# EAGLE design schematics (EAGLE 9.6.2)
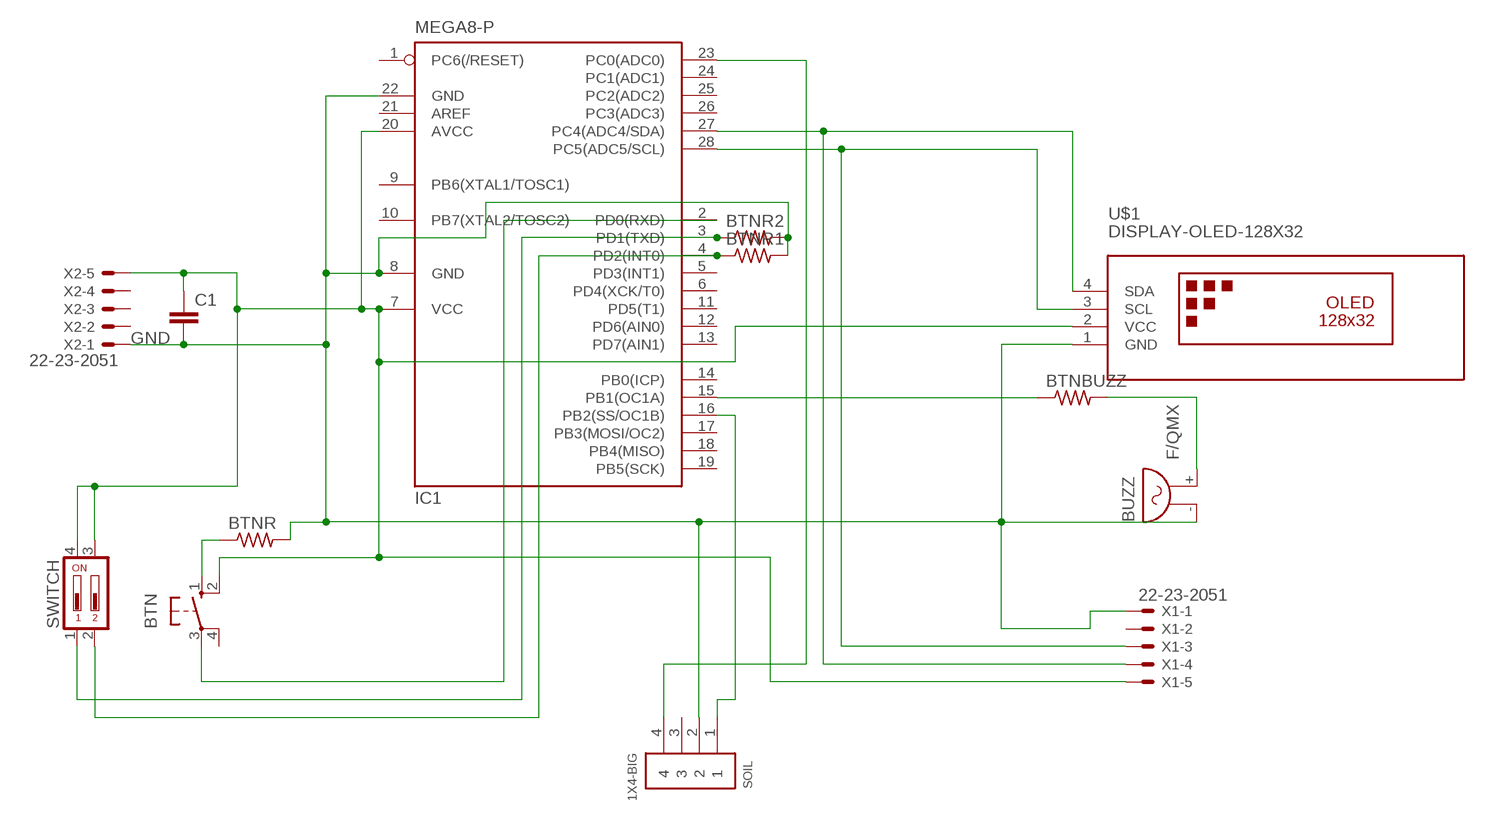
[diagram p0: schematic, sheet 1]

## Parts
BTN  10-XX  [B3F-10XX]
BTNBUZZ  R-US_0204/7  [0204/7]
BTNR  R-US_0204/7  [0204/7]
BTNR1  R-US_0204/7  [0204/7]
BTNR2  R-US_0204/7  [0204/7]
BUZZ  F/QMX  [F/QMX]
C1  C-EU025-025X050  [C025-025X050]
IC1  MEGA8-P  [DIL28-3]
SOIL  1X4-BIG  [1X04-BIG]
SWITCH  DIP02YL  [DIP02YL]
U$1  DISPLAY-OLED-128X32  [DISPLAY-OLED-128X32]
X1  22-23-2051  [22-23-2051]
X2  22-23-2051  [22-23-2051]

## Nets
GND: BTNR1.2 BTNR2.2 BTNR.2 BUZZ.- C1.2 IC1.8(GND) IC1.22(GND) SOIL.2 U$1.1(GND) X1.1 X2.1
N$1: IC1.27(PC4(ADC4/SDA)) U$1.4(SDA) X1.4
N$2: IC1.28(PC5(ADC5/SCL)) U$1.3(SCL) X1.3
N$3: BTNR2.1 IC1.3(PD1(TXD)) SWITCH.1
N$4: BTNBUZZ.1 IC1.15(PB1(OC1A))
N$5: BTN.2(S1) C1.1 IC1.7(VCC) IC1.20(AVCC) SWITCH.3 SWITCH.4 U$1.2(VCC) X1.5 X2.5
N$6: IC1.16(PB2(SS/OC1B)) SOIL.1
N$7: BTN.1(S) BTNR.1
N$8: BTN.3(P) IC1.2(PD0(RXD))
N$9: IC1.23(PC0(ADC0)) SOIL.4
N$10: BTNR1.1 IC1.4(PD2(INT0)) SWITCH.2
N$11: BTNBUZZ.2 BUZZ.+
Unconnected: BTN.4(P1) IC1.1(PC6(/RESET)) IC1.5(PD3(INT1)) IC1.6(PD4(XCK/T0)) IC1.9(PB6(XTAL1/TOSC1)) IC1.10(PB7(XTAL2/TOSC2)) IC1.11(PD5(T1)) IC1.12(PD6(AIN0)) IC1.13(PD7(AIN1)) IC1.14(PB0(ICP)) IC1.17(PB3(MOSI/OC2)) IC1.18(PB4(MISO)) IC1.19(PB5(SCK)) IC1.21(AREF) IC1.24(PC1(ADC1)) IC1.25(PC2(ADC2)) IC1.26(PC3(ADC3)) SOIL.3 X1.2 X2.2 X2.3 X2.4

## Library data of the parts
BTN = switch-omron:10-XX: OMRON SWITCH; MPN: B3F-1000; OC_FARNELL: 176432; OC_NEWARK: 36M3542
BTNBUZZ BTNR BTNR1 BTNR2 = adafruit:R-US_: RESISTOR, American symbol
BUZZ = buzzer:F/QMX: BUZZER Source: Buerklin; OC_FARNELL: unknown; OC_NEWARK: unknown
C1 = rcl:C-EU: CAPACITOR, European symbol; SPICEPREFIX: C
IC1 = atmel:MEGA8-P: MICROCONTROLLER 8 Kbytes FLASH, 1 kbytes SRAM, 512 bytes EEPROM, USART, 4-channel 10 bit ADC, 2-channel 8 bit ADC Pin compatible with Atmega48, ATMega88, ATMega168 Source: avr.lbr; OC_FARNELL: unknown; OC_NEWARK: unknown
SOIL = adafruit:1X4: 4-pin connector
SWITCH = switch-dil:DIP02YL: DIL/CODE SWITCH; OC_FARNELL: unknown; OC_NEWARK: unknown
U$1 = diy-modules:DISPLAY-OLED-128X32: 128x32 Dot Matrix OLED Module with I2C interface based on SSD1306 chip More details available here: http://www.tinyosshop.com/index.php?route=product/product&product_id=953 Schematic available here: http://www.tinyosshop.com/datasheet/OLED%2012832.pdf SSD1306 datasheet: https://cdn-shop.adafruit.com/datasheets/SSD1306.pdf Click here to find device on ebay.com <http://www.ebay.com/sch/oled+display+128x32+i2c>
X1 X2 = con-molex:22-23-2051: .100" (2.54mm) Center Header - 5 Pin; MF: MOLEX; MPN: 22-23-2051; OC_FARNELL: 1462952; OC_NEWARK: 38C9178

## Board
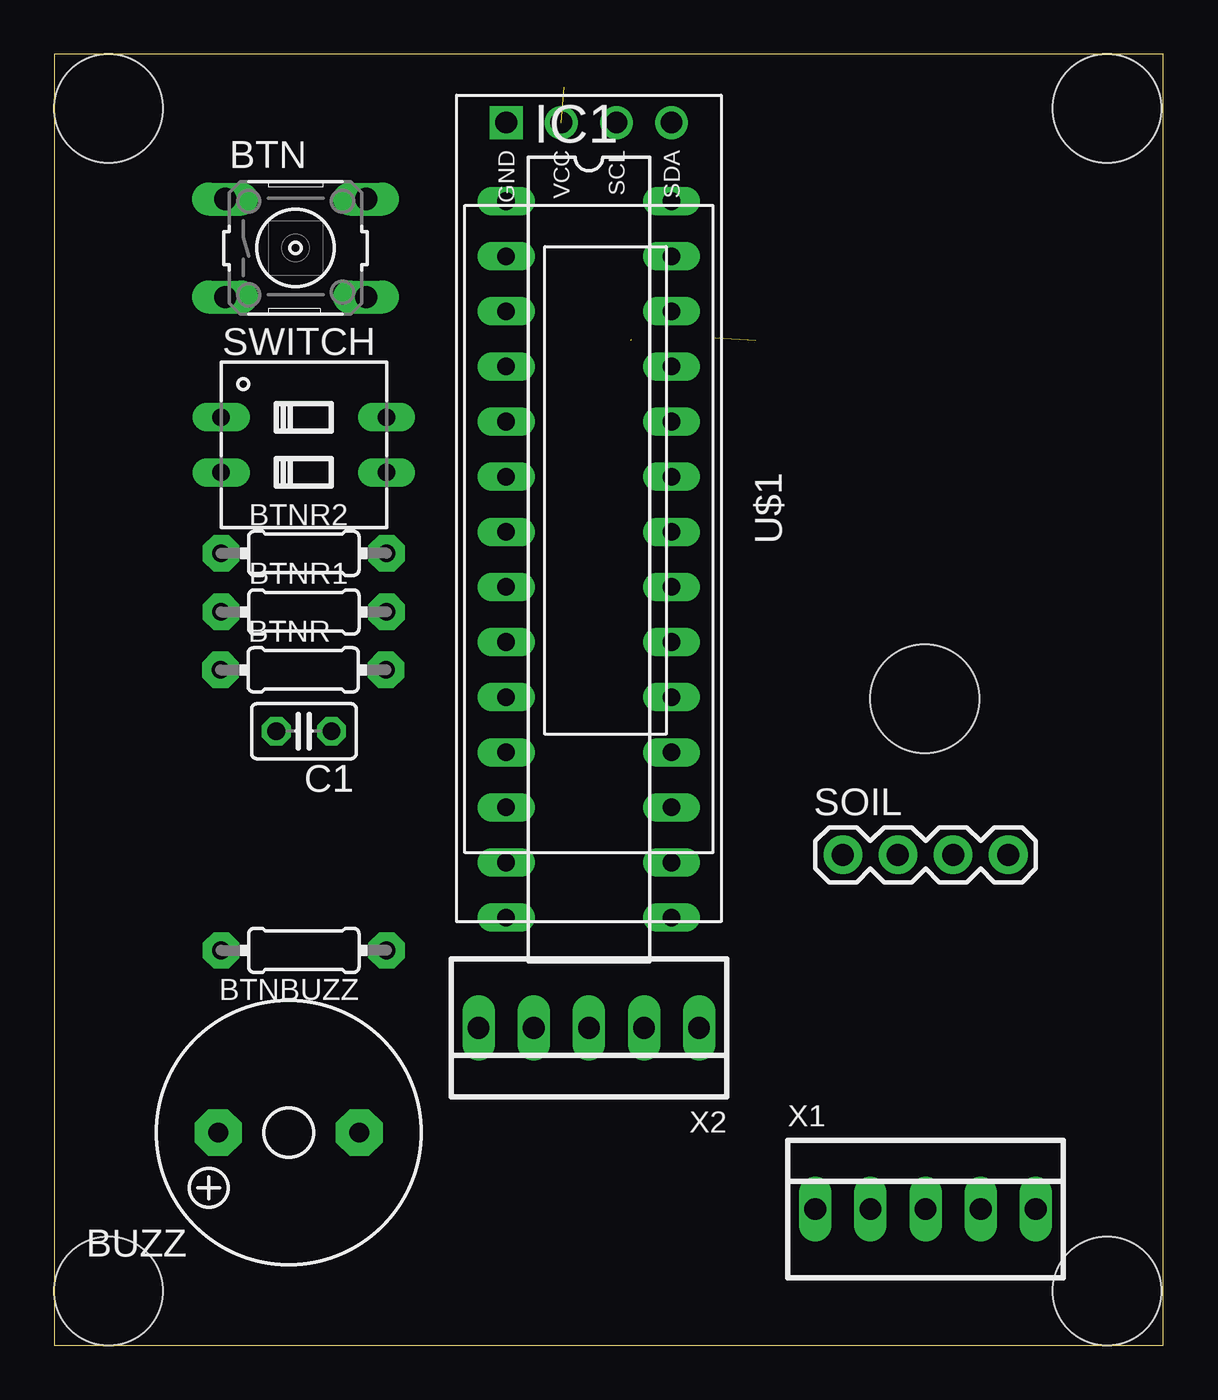
[diagram p1: board, top side]
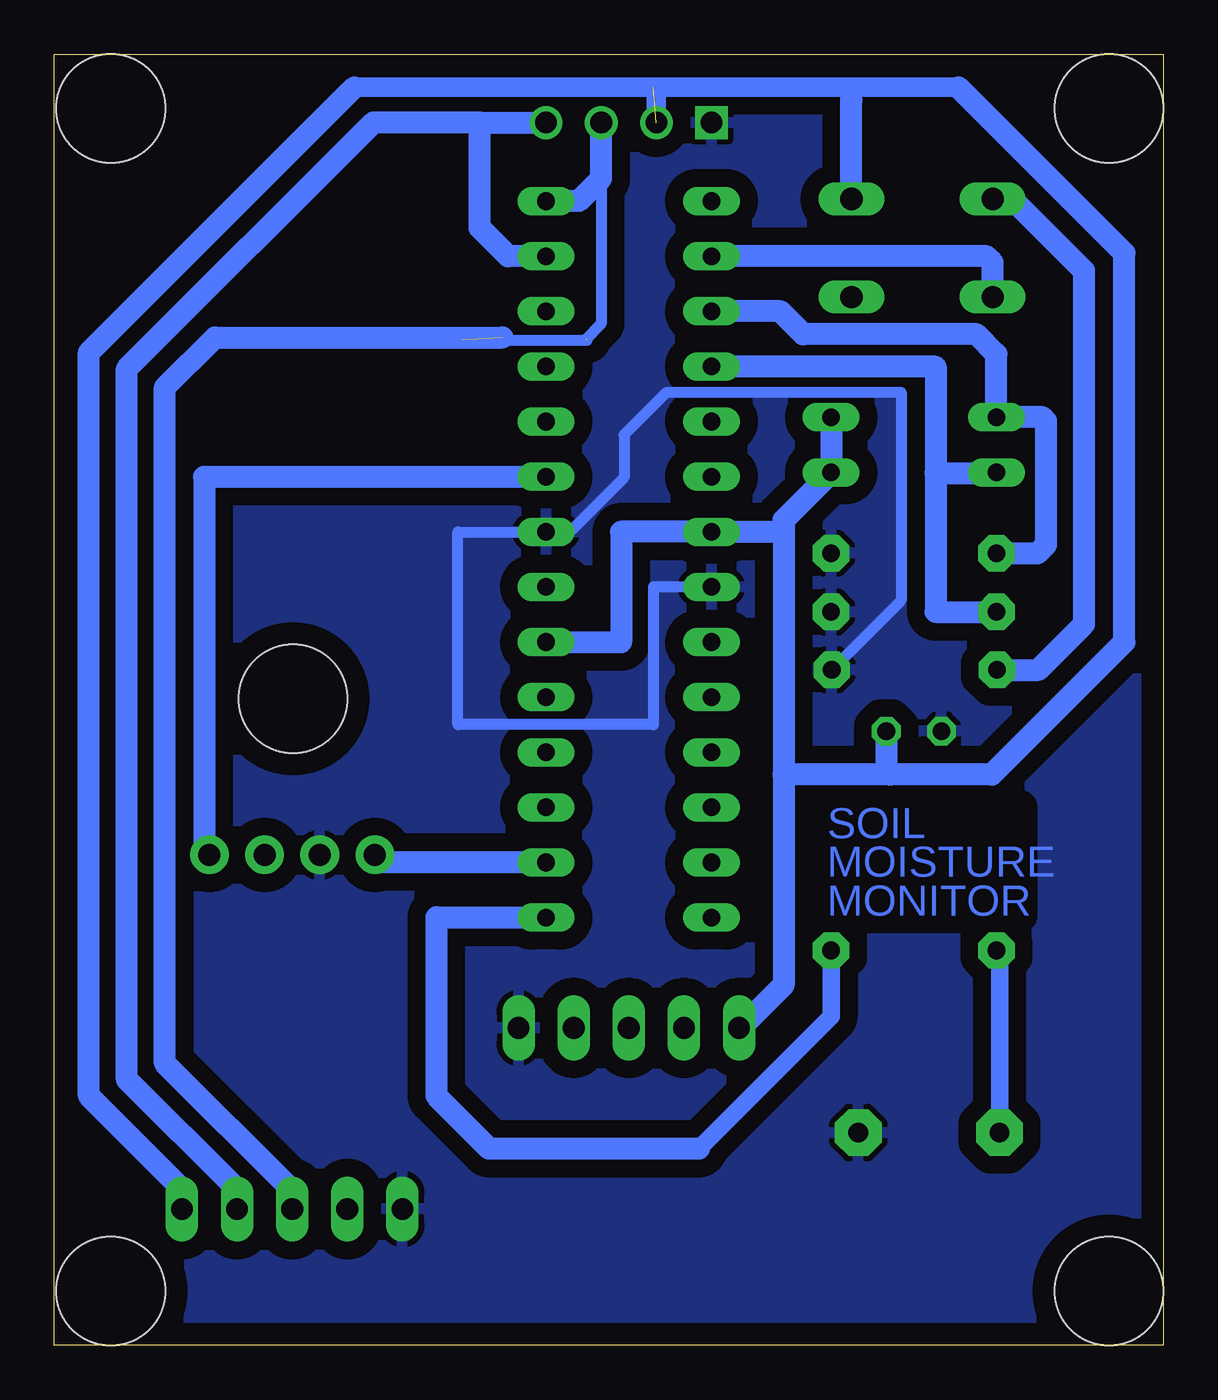
[diagram p2: board, bottom side, seen from below]

Size 51.1 x 59.5 mm. Coordinates in mm from the lower left corner, seen from the top.
Outline: 0,0 51.1,0 51.1,59.5 0,59.5 0,0
Copper layers (1*16): Top 0.035mm / dielectric 1.5mm / Bottom 0.035mm
Design rules "default *": minimum track width 6mil, minimum drill 0.35mm, track to track 6mil, track to pad 6mil, pad to pad 6mil, via to via 6mil, smd to smd 6mil, copper to edge 40mil, drill to drill 6mil, minimum pad ring 10mil, minimum via ring 8mil, stop-mask expansion 4mil, vias tented up to drill 0mil, thermal gap 10mil
Holes 5 mm at 2.5,2.5 48.5,2.5 48.5,57 2.5,57 40.1,29.8

### Footprints (pad centres in the part's own frame; a part is rotated, then mirrored left to right if it is on the bottom)
B3F-10XX = drill 1.016 long: 1 -3.251,2.261; 2 3.251,2.261; 3 -3.251,-2.261; 4 3.251,-2.261
0204/7 = drill 0.813 pad 1.676 octagon: 1 -3.81,0; 2 3.81,0
F/QMX = drill 0.914 pad 2.159 octagon: + 3.251,0; - -3.251,0
C025-025X050 = drill 0.813 octagon: 1 -1.27,0; 2 1.27,0
DIL28-3 = drill 0.813 long: 1 -16.51,-3.81; 2 -13.97,-3.81; 3 -11.43,-3.81; 4 -8.89,-3.81; 5 -6.35,-3.81; 6 -3.81,-3.81; 7 -1.27,-3.81; 8 1.27,-3.81; 9 3.81,-3.81; 10 6.35,-3.81; 11 8.89,-3.81; 12 11.43,-3.81; 13 13.97,-3.81; 14 16.51,-3.81; 15 16.51,3.81; 16 13.97,3.81; 17 11.43,3.81; 18 8.89,3.81; 19 6.35,3.81; 20 3.81,3.81; 21 1.27,3.81; 22 -1.27,3.81; 23 -3.81,3.81; 24 -6.35,3.81; 25 -8.89,3.81; 26 -11.43,3.81; 27 -13.97,3.81; 28 -16.51,3.81
1X04-BIG = drill 1.016 pad 1.778: 1 0,0; 2 2.54,0; 3 5.08,0; 4 7.62,0
DIP02YL = drill 0.813 long: 1 -1.27,-3.81; 2 1.27,-3.81; 3 1.27,3.81; 4 -1.27,3.81
DISPLAY-OLED-128X32 = drill 1 square: 1 -17.78,-3.81 | drill 1: 2 -17.78,-1.27; 3 -17.78,1.27; 4 -17.78,3.81
22-23-2051 = drill 1 long: 1 -5.08,0; 2 -2.54,0; 3 0,0; 4 2.54,0; 5 5.08,0

### Placement (x,y rotation side)
BTN  11.12,50.57 0 top
BTNBUZZ  11.5,18.2 180 top
BTNR  11.47,31.13 0 top
BTNR1  11.5,33.8 0 top
BTNR2  11.5,36.5 0 top
BUZZ  10.8,9.8 180 top
C1  11.5,28.3 180 top
IC1  24.63,36.22 270 top
SOIL  36.33,22.6 0 top
SWITCH  11.5,41.5 270 top
U$1  24.63,38.57 270 top
X1  40.14,6.28 0 top
X2  24.63,14.63 180 top

### Tracks (layer width: path | path; a pad name or v marks a point on that pad's centre or on a via)
GND
  Bottom 0.508: IC1.8 23.5,34.95 23.5,28.6 32.5,28.6 32.5,37.49 IC1.22 27.34,37.49 24.84,39.99 24.84,41.96 22.88,43.92 12.08,43.92 12.08,34.33 BTNR.2
  pour Bottom (isolate 0.813): 0,59.5 0,0 51.25,0 51.25,59.5
N$1
  Bottom 1.016: X1.4 42.68,7.18 47.75,12.25 47.75,45 36.4,56.35 31.5,56.35 | 31.5,56.35 U$1.4 | IC1.27 30.19,50.19 31.5,51.5 31.5,56.35
N$2  (2 unrouted)
  Bottom 0.508: 26.6,46.37 25.9,47.08 25.9,53.77 | 32.32,46.32 26.55,46.32
  Bottom 1.016: X1.3 40.14,7.14 46,13 46,44.15 43.7,46.45 30.45,46.45 | IC1.28 26.94,52.73 25.9,53.77 U$1.3
N$3
  Bottom 1.016: IC1.3 17.65,47.65 16.6,46.6 8.6,46.6 7.69,45.69 SWITCH.1 5.57,42.77 5.4,42.6 5.4,36.9 5.8,36.5 BTNR2.1
N$4
  Bottom 0.813: BTNBUZZ.1 15.31,15.15 21.4,9.06
  Bottom 1.016: IC1.15 28.46,19.73 33.5,19.73 33.5,11.5 31.06,9.06 21.4,9.06
N$5  (1 unrouted)
  Bottom 0.813: 14.4,57.4 14.4,57.88 14.3,57.98
  Bottom 0.9: 9.44,57.98 14.3,57.98 23.36,57.98 U$1.2 | 23.5,57.98 37.27,57.98
  Bottom 1.016: 19.5,14.5 19.55,14.55 | 19.55,14.55 X2.5 | IC1.20 24.98,32.41 24.98,37.5 IC1.7 | IC1.7 | IC1.7 17.5,37.5 | 17.5,37.5 17.5,26.3 | 17.5,26.3 17.5,16.6 19.55,14.55 | 12.6,26.3 7.9,26.3 1.8,32.4 1.8,50.33 9.44,57.98 | 12.6,26.3 17.5,26.3 | X1.5 45.22,7.22 49.5,11.5 49.5,45.75 37.27,57.98 | C1.1 12.77,26.47 12.6,26.3 | SWITCH.4 SWITCH.3 17.5,38.04 17.5,37.5 | BTN.2 14.37,57.37 14.4,57.4
N$6
  Bottom 1.016: IC1.16 28.46,22.27 36,22.27 SOIL.1
N$7
  Bottom 1.016: BTN.1 6.97,52.83 3.67,49.53 3.67,33.22 5.76,31.13 BTNR.1
N$8
  Bottom 1.016: BTN.3 7.87,49.91 8.07,50.11 8.15,50.19 IC1.2
N$9
  Bottom 1.016: SOIL.4 44.2,22.85 44.2,40.03 IC1.23
N$10
  Bottom 1.016: SWITCH.2 7.72,40.2 10.5,40.2 | 10.5,40.2 10.5,45.1 20.8,45.1 IC1.4 | 10.5,40.2 10.5,33.8 BTNR1.1
N$11
  Bottom 0.813: BUZZ.+ 7.55,18.06 BTNBUZZ.2

### Text on the board
Bottom: SOIL / MOISTURE / MONITOR